# Altium schematic sheet analog_interface.SchDoc
size A4
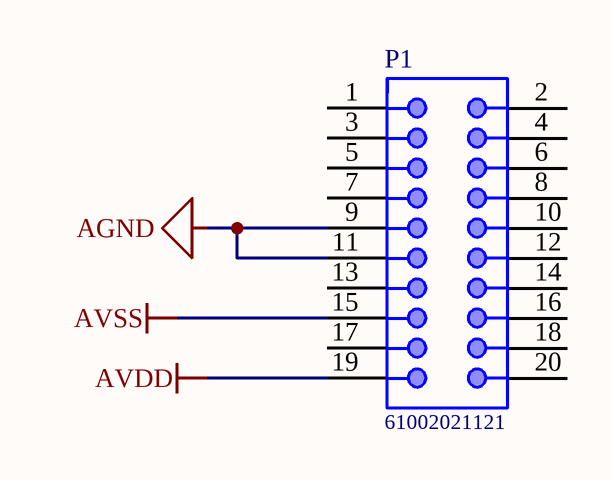
[diagram p0: analog_interface.SchDoc]

## Parts
P1  61002021121  [61002021121]

## Nets
AGND: P1.9 P1.11
AVDD: P1.19
AVSS: P1.15

Not connected (* = marked no-connect by the designer): P1 1 2 3 4 5 6 7 8 10 12 13 14 16 17 18 20

## Library data of the parts
P1 = 61002021121: SMT Vertical Pin Header WR-PHD, Pitch 2.54 mm, Dual Row, 20 pins; Pin Number: 20; Pitch: 2.54 mm; Gender: Male; Rated Current: 3 A; Working Voltage: 250 VAC; Withstanding Voltage: 500 VAC; Contact Resistance: 20 mOhm; ComponentLink1Description: Manufacturer; ComponentLink1URL: http://www.we-online.de; ComponentLink2Description: Datasheet; ComponentLink2URL: https://katalog.we-online.de/em/datasheet/6100xx21121.pdf; Part Number: 61002021121; Published Date: August 2018; Publisher: Wurth Elektronik; Operating Temperature: -40 to 125 degC; Mounting Technology: SMT; Packaging: Tube; Row Number: Dual; Orientation: Vertical